# Altium schematic sheet Pg07_ DDR3_Memory.SchDoc: DDR3 MEMORY
size A2; DrawnBy: RvS; DocumentNumber: 7; SheetNumber: 7; SheetTotal: 16
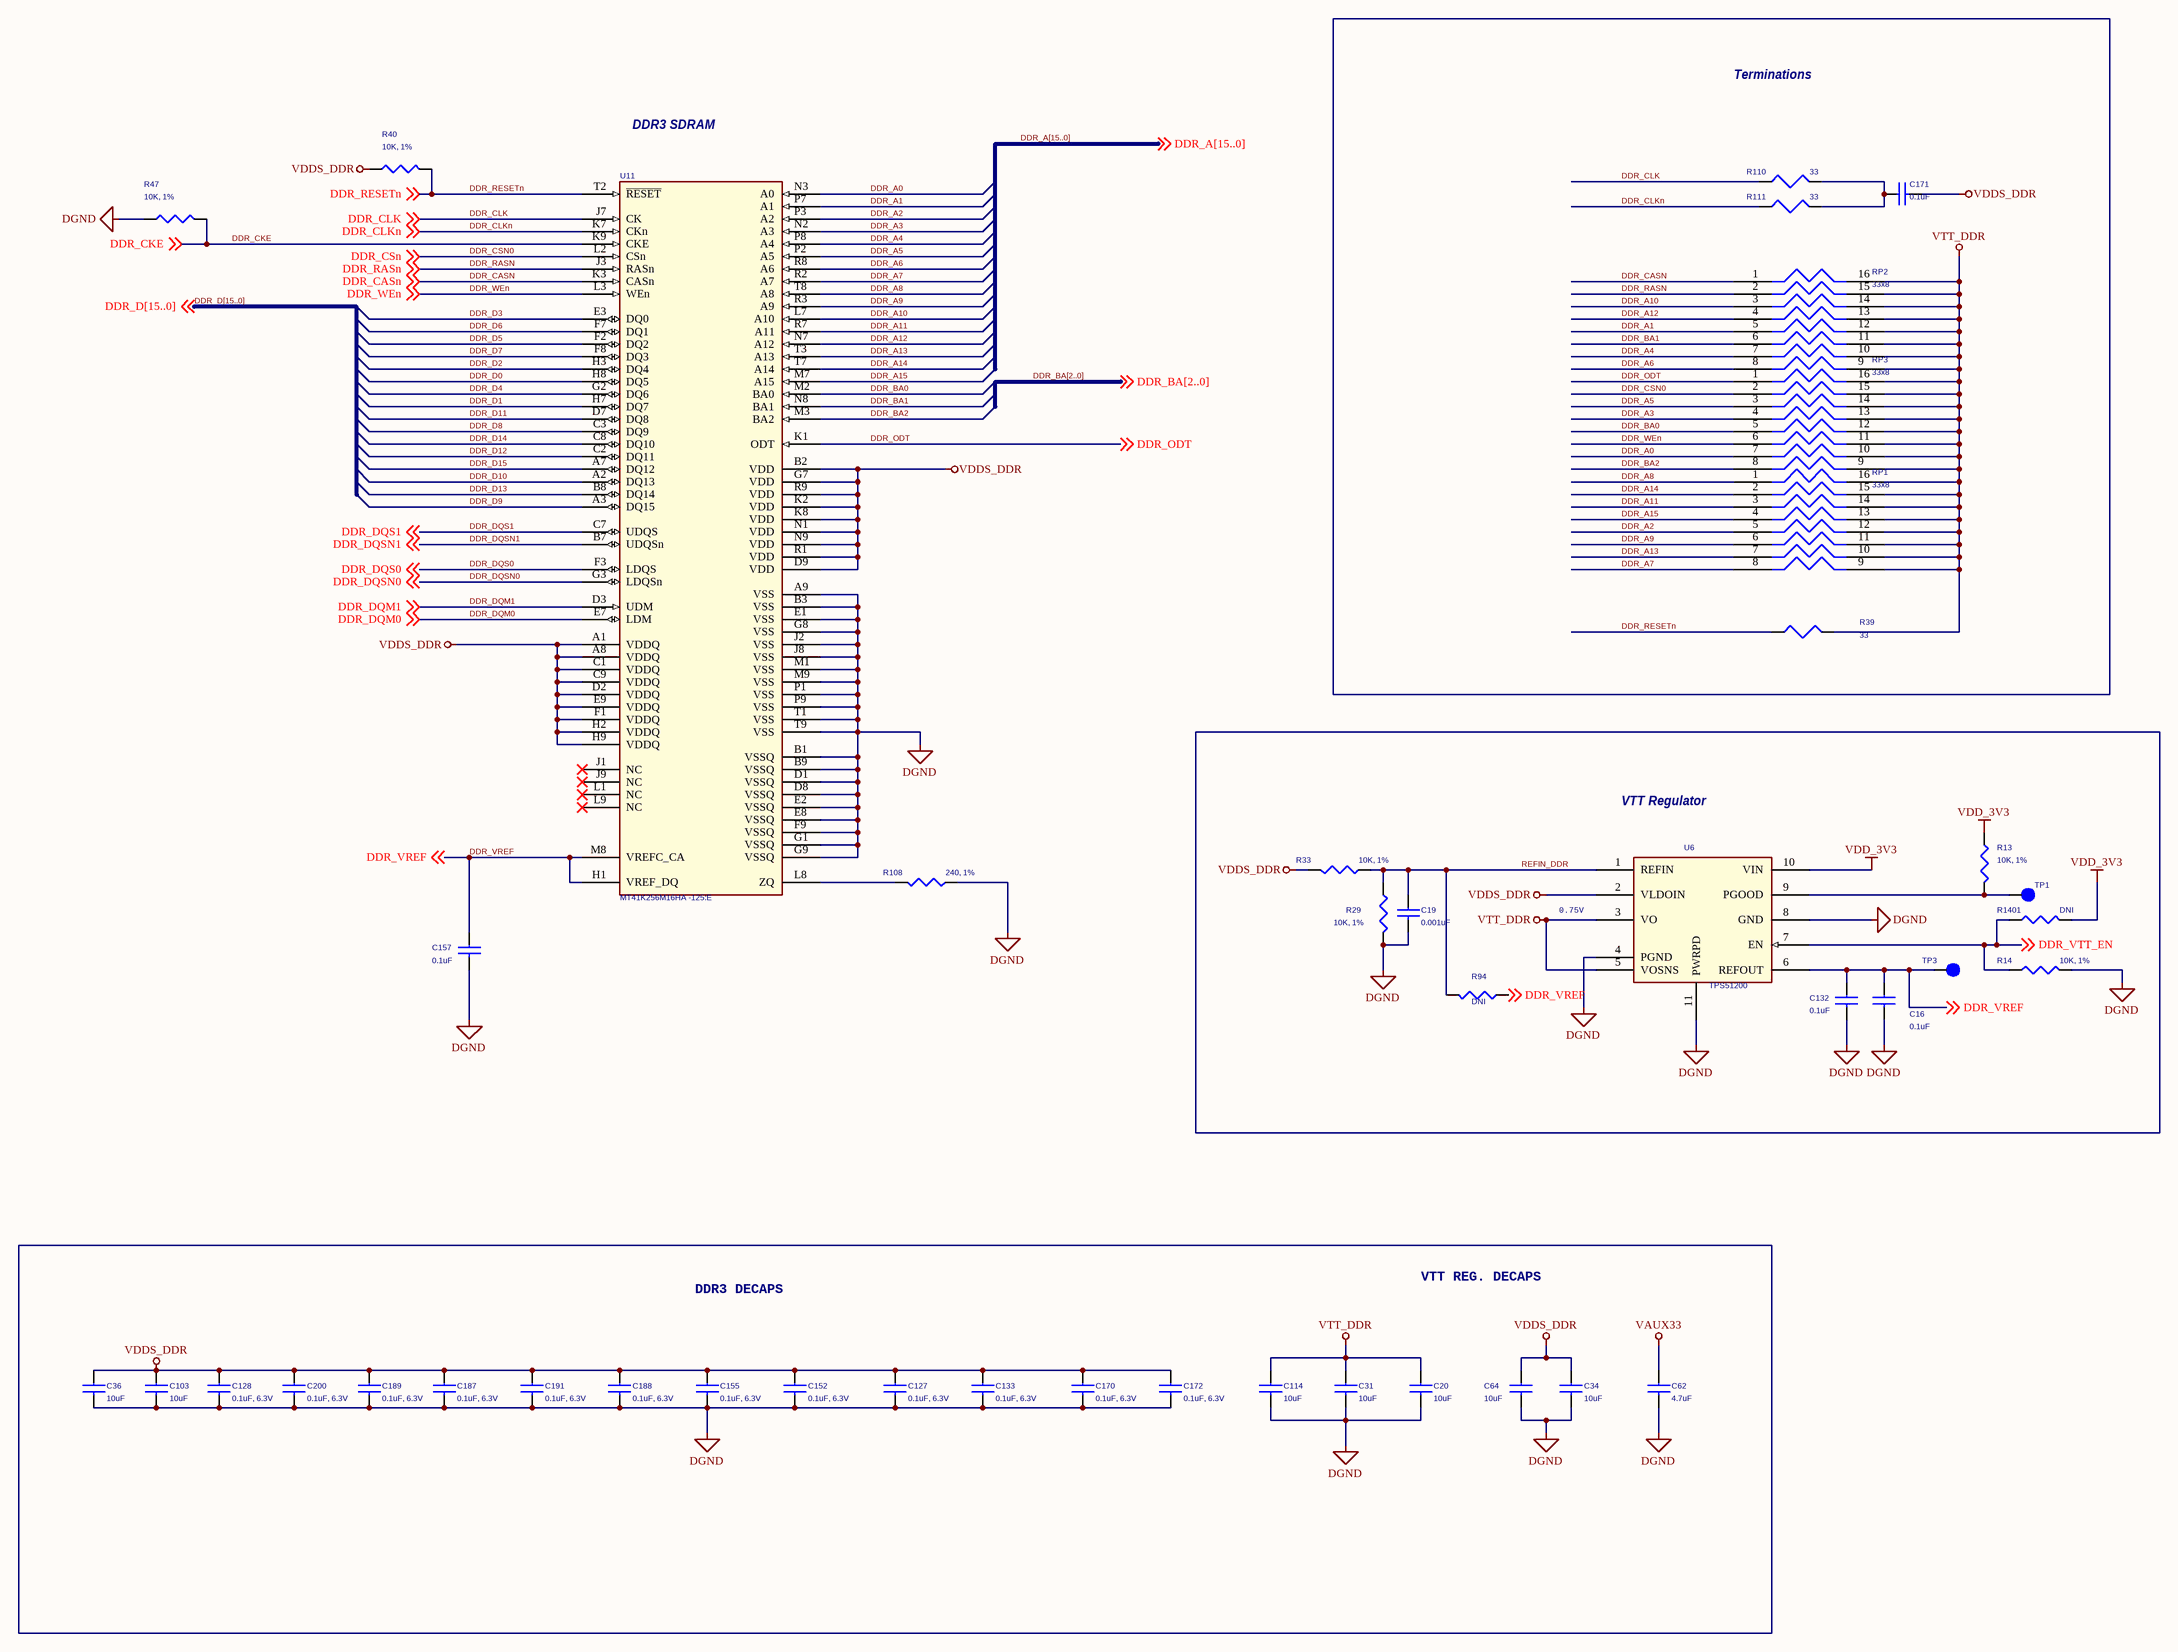
[diagram p0: Pg07_ DDR3_Memory.SchDoc]

## Parts
?  (no value)  (graphical)
C16  0.1uF  [SM-7351-CAP-0402]
C19  0.001uF  [SM-7351-CAP-0402]
C20  10uF  [SM-7351-CAP-0805]
C31  10uF  [SM-7351-CAP-0805]
C34  10uF  [SM-7351-CAP-0805]
C36  10uF  [SM-7351-CAP-0805]
C62  4.7uF  [SM-7351-CAP-0603]
C64  10uF  [SM-7351-CAP-0805]
C103  10uF  [SM-7351-CAP-0805]
C114  10uF  [SM-7351-CAP-0805]
C127  0.1uF, 6.3V  [SM-7351-CAP-0402]
C128  0.1uF, 6.3V  [SM-7351-CAP-0402]
C132  0.1uF  [SM-7351-CAP-0402]
C133  0.1uF, 6.3V  [SMD0201]
C152  0.1uF, 6.3V  [SM-7351-CAP-0402]
C155  0.1uF, 6.3V  [SMD0201]
C157  0.1uF  [SM-7351-CAP-0402]
C170  0.1uF, 6.3V  [SM-7351-CAP-0402]
C171  0.1uF  [SM-7351-CAP-0402]
C172  0.1uF, 6.3V  [SM-7351-CAP-0402]
C187  0.1uF, 6.3V  [SM-7351-CAP-0402]
C188  0.1uF, 6.3V  [SM-7351-CAP-0402]
C189  0.1uF, 6.3V  [SM-7351-CAP-0402]
C191  0.1uF, 6.3V  [SM-7351-CAP-0402]
C200  0.1uF, 6.3V  [SMD0201]
R13  10K, 1%  [SM-7351-RES-0402]
R14  10K, 1%  [SM-7351-RES-0402]
R29  10K, 1%  [SM-7351-RES-0402]
R33  10K, 1%  [SM-7351-RES-0402]
R39  33  [SM-7351-RES-0402]
R40  10K, 1%  [SM-7351-RES-0402]
R47  10K, 1%  [SM-7351-RES-0402]
R94  DNI  [SM-7351-RES-0402]
R108  240, 1%  [SM-7351-RES-0402]
R110  33  [SM-7351-RES-0402]
R111  33  [SM-7351-RES-0402]
R1401  DNI  [SM-7351-RES-0402]
RP1  33x8  [sm_rpak_exb-2hv]
RP2  33x8  [sm_rpak_exb-2hv]
RP3  33x8  [sm_rpak_exb-2hv]
TP1  TP1mm  [tp_smd1mmcircle]  (value not drawn)
TP3  TP1mm  [tp_smd1mmcircle]  (value not drawn)
U6  TPS51200  [SON10]
U11  MT41K256M16HA -125:E  [BGA14X10-96]

## Blocks framed on the sheet
Terminations: C171 R39 R110 R111 RP1-RP3
VTT Regulator: C16 C19 C132 R13 R14 R29 R33 R94 R1401 TP1 TP3 U6

## Nets
DGND: C16.2 C19.2 C20.2 C31.2 C34.2 C36.2 C62.2 C64.2 C103.2 C114.2 C127.2 C128.2 C132.2 C133.2 C152.2 C155.2 C157.2 C170.2 C172.2 C187.2 C188.2 C189.2 C191.2 C200.2 R14.2 R29.2 R47.1 R108.1 U6.4(PGND) U6.8(GND) U6.11(PWRPD) U11.A9(VSS) U11.B1(VSSQ) U11.B3(VSS) U11.B9(VSSQ) U11.D1(VSSQ) U11.D8(VSSQ) U11.E1(VSS) U11.E2(VSSQ) U11.E8(VSSQ) U11.F9(VSSQ) U11.G1(VSSQ) U11.G8(VSS) U11.G9(VSSQ) U11.J2(VSS) U11.J8(VSS) U11.M1(VSS) U11.M9(VSS) U11.P1(VSS) U11.P9(VSS) U11.T1(VSS) U11.T9(VSS)
VAUX33: C62.1
VDD_3V3: R13.1 R1401.2 U6.10(VIN)
VDDS_DDR: C34.1 C36.1 C64.1 C103.1 C127.1 C128.1 C133.1 C152.1 C155.1 C170.1 C171.2 C172.1 C187.1 C188.1 C189.1 C191.1 C200.1 R33.2 R40.1 U6.2(VLDOIN) U11.A1(VDDQ) U11.A8(VDDQ) U11.B2(VDD) U11.C1(VDDQ) U11.C9(VDDQ) U11.D2(VDDQ) U11.D9(VDD) U11.E9(VDDQ) U11.F1(VDDQ) U11.G7(VDD) U11.H2(VDDQ) U11.H9(VDDQ) U11.K2(VDD) U11.K8(VDD) U11.N1(VDD) U11.N9(VDD) U11.R1(VDD) U11.R9(VDD)
VTT_DDR: C20.1 C31.1 C114.1 R39.2 RP1.9 RP1.10 RP1.11 RP1.12 RP1.13 RP1.14 RP1.15 RP1.16 RP2.9 RP2.10 RP2.11 RP2.12 RP2.13 RP2.14 RP2.15 RP2.16 RP3.9 RP3.10 RP3.11 RP3.12 RP3.13 RP3.14 RP3.15 RP3.16 U6.3(VO) U6.5(VOSNS)
DDR_A0: RP3.7 U11.N3(A0)
DDR_A1: RP2.5 U11.P7(A1)
DDR_A2: RP1.5 U11.P3(A2)
DDR_A3: RP3.4 U11.N2(A3)
DDR_A4: RP2.7 U11.P8(A4)
DDR_A5: RP3.3 U11.P2(A5)
DDR_A6: RP2.8 U11.R8(A6)
DDR_A7: RP1.8 U11.R2(A7)
DDR_A8: RP1.1 U11.T8(A8)
DDR_A9: RP1.6 U11.R3(A9)
DDR_A10: RP2.3 U11.L7(A10)
DDR_A11: RP1.3 U11.R7(A11)
DDR_A12: RP2.4 U11.N7(A12)
DDR_A13: RP1.7 U11.T3(A13)
DDR_A14: RP1.2 U11.T7(A14)
DDR_A15: RP1.4 U11.M7(A15)
DDR_BA0: RP3.5 U11.M2(BA0)
DDR_BA1: RP2.6 U11.N8(BA1)
DDR_BA2: RP3.8 U11.M3(BA2)
DDR_CASN: RP2.1 U11.K3(CASn) ; off-sheet DDR_CASn
DDR_CKE: R47.2 U11.K9(CKE) ; off-sheet DDR_CKE
DDR_CLK: R110.1 U11.J7(CK) ; off-sheet DDR_CLK
DDR_CLKn: R111.1 U11.K7(CKn) ; off-sheet DDR_CLKn
DDR_CSN0: RP3.2 U11.L2(CSn) ; off-sheet DDR_CSn  [also labelled DDR_CSn]
DDR_D0: U11.H8(DQ5)
DDR_D1: U11.H7(DQ7)
DDR_D2: U11.H3(DQ4)
DDR_D3: U11.E3(DQ0)
DDR_D4: U11.G2(DQ6)
DDR_D5: U11.F2(DQ2)
DDR_D6: U11.F7(DQ1)
DDR_D7: U11.F8(DQ3)
DDR_D8: U11.C3(DQ9)
DDR_D9: U11.A3(DQ15)
DDR_D10: U11.A2(DQ13)
DDR_D11: U11.D7(DQ8)
DDR_D12: U11.C2(DQ11)
DDR_D13: U11.B8(DQ14)
DDR_D14: U11.C8(DQ10)
DDR_D15: U11.A7(DQ12)
DDR_DQM0: U11.E7(LDM) ; off-sheet DDR_DQM0
DDR_DQM1: U11.D3(UDM) ; off-sheet DDR_DQM1
DDR_DQS0: U11.F3(LDQS) ; off-sheet DDR_DQS0
DDR_DQS1: U11.C7(UDQS) ; off-sheet DDR_DQS1
DDR_DQSN0: U11.G3(LDQSn) ; off-sheet DDR_DQSN0
DDR_DQSN1: U11.B7(UDQSn) ; off-sheet DDR_DQSN1
DDR_ODT: RP3.1 U11.K1(ODT) ; off-sheet DDR_ODT
DDR_RASN: RP2.2 U11.J3(RASn) ; off-sheet DDR_RASn
DDR_RESETn: R39.1 R40.2 U11.T2(~{RESET}) ; off-sheet DDR_RESETn
DDR_VREF: C16.1 C132.1 C157.1 R94.1 TP3.1 U6.6(REFOUT) U11.H1(VREF_DQ) U11.M8(VREFC_CA) ; off-sheet DDR_VREF
DDR_VTT_EN: R14.1 R1401.1 U6.7(EN) ; off-sheet DDR_VTT_EN
DDR_WEn: RP3.6 U11.L3(WEn) ; off-sheet DDR_WEn
REFIN_DDR: C19.1 R29.1 R33.1 R94.2 U6.1(REFIN)
NetC171_1: C171.1 R110.2 R111.2
NetR13_2: R13.2 TP1.1 U6.9(PGOOD)
NetR108_2: R108.2 U11.L8(ZQ)

Not connected (* = marked no-connect by the designer): U11 J1(NC)* J9(NC)* L1(NC)* L9(NC)*

## Buses and harness runs
bus DDR_A[15..0]
bus DDR_BA[2..0]
bus DDR_D[15..0]

## Notes on the sheet
- DDR3 SDRAM
- 0.75V
- VTT REG. DECAPS
- DDR3 DECAPS
- Embedded Vision Systems Group
- Title
- School of Electrical and Electronic Engineering
- Date:
- Size
- Document Number
- Sheet
- of
- Rev

## Library data of the parts
? = Title Block Address(1): UoM title block
C16 C132 C157 C171 = 0.1uFCapacitor16V10%0402_Dup1: TIIntPartnumber: 1C0089; MfrNum: C0402C104K4RACT; Mfr: Kemet; PartName: 0.1uF16V10%SMD0402; DescriptiveText: Capacitor 0.1uF 16V 10% 0402 X7R; Cost10K: 0.015; Cost100: 0.11; Vendor: Digikey
C19 = 0.001uFCapacitor50V5%0402: Mfr: AVX; PartName: 0.001uF50V5%SMD0402; MfrNum: 04025C102JAT2A; TIIntPartnumber: 1C0093; PN: 0402YC103KAT2A; TN: 207-0054-000; Vendor: Digikey; Cost100: 0.015; Cost10K: 0.007; DescriptiveText: Capacitor 0.001uF 50V 5% 0402
C20 C31 C34 C36 C64 C103 C114 = 10uFCapacitor16V10%0805: Capacitor 10uF 16V 10% Ceramic 0805; PartName: 10uF16V10%SMD0805; Mfr: AVX; MfrNum: 0805YD106KAT2A; TIIntPartnumber: 1C0085; Vendor: Digikey; Cost100: 0.19; Cost10K: 0.042; Descriptive_Text: Capacitor 10uF 16V 10% Ceramic 0805; DescriptiveText: Capacitor 10uF 16V 10% Ceramic 0805
C62 = 4.7uFCapacitor16V10%0603: TIIntPartnumber: 1C0103; MfrNum: EMK107ABJ475KA-T; Mfr: Taiyo Yuden; PartName: 4.7uF16V10%SMD0603; Cost10K: 0.00590; Cost100: 0.0198; Vendor: Digikey; DescriptiveText: Capacitor Ceramic 4.7uF 16V 10% 0603
C127 C128 C133 C152 C155 C170 C172 C187-C189 C191 C200 = 0.1uFCapacitor6.3V10%0201: PartName: 0.1uF6.3V10%smd0201; Mfr: Murata; MfrNum: GRM033R60J104KE19D; TIIntPartnumber: 1C0122; Vendor: Digikey; Cost100: 0.029; Cost10K: 0.0090; DescriptiveText: Capacitor 0.1uF 6.3V 10% 0201 X5R
R13 R29 R33 R94 = 10KOhmResistor1/10W1%0402_Dup3: TIIntPartnumber: 1R0254; MfrNum: ERJ-2RKF1002X; Mfr: Panasonic-ECG; PartName: 10Kohm1/10W1%smd0402; DescriptiveText: Resistor 10Kohm 1/10W 1% 0402; Cost10K: 0.00291; Cost100: 0.011; Vendor: Digikey
R14 R1401 = 10KOhmResistor1/10W1%0402: TIIntPartnumber: 1R0254; MfrNum: ERJ-2RKF1002X; Mfr: Panasonic-ECG; PartName: 10Kohm1/10W1%smd0402; DescriptiveText: Resistor 10Kohm 1/10W 1% 0402; Cost10K: 0.00291; Cost100: 0.011; Vendor: Digikey
R39 R110 R111 = 33ohmResistor1/16W5%0402: Resistor 33ohm 1/16W 5% 0402; PartName: 33ohm1/16W5%SMD; Mfr: Panasonic; MfrNum: ERJ-2GEJ330X; TIIntPartnumber: 1R0008; Vendor: Digikey; Cost100: 0.02595; Cost10K: 0.0020; Descriptive_Text: Resistor 33ohm 1/16W 5% 0402; DescriptiveText: Resistor 33ohm 1/16W 5% 0402
R40 R47 = 10KOhmResistor1/10W1%0402_Dup1: TIIntPartnumber: 1R0254; MfrNum: ERJ-2RKF1002X; Mfr: PANASONIC-ECG; PartName: 10Kohm1/10W1%smd0402; DescriptiveText: Resistor 10Kohm 1/10W 1% 0402; Cost10K: 0.00291; Cost100: 0.011; Vendor: DIGIKEY
R108 = 240OhmResistor1/10W1%0402: PartName: 240ohm1/10W1%smd0402; Mfr: Panasonic-ECG; MfrNum: ERJ-2RKF2400X; TIIntPartnumber: 1R0249; Vendor: Digikey; Cost100: 0.02; Cost10K: 0.00132; DescriptiveText: Resistor 240 OHM 1/10W 1% 0402 SMD
RP1-RP3 = 33ohmx8_1/16W5%smd: Resistor 33ohmx8 1/16W 5% Array SMD; Mfr: Panasonic; MfrNum: EXB-2HV330JV; TIIntPartnumber: 1R0196; Vendor: Digikey; Cost100: 0.007; Cost10K: 0.02465; DescriptiveText: Resistor 33ohmx8 1/16W 5% Array SMD; PartName: 33ohmx8_1/16W5%smd; Descriptive_Text: Resistor 33ohmx8 1/16W 5% Array SMD
TP1 TP3 = Testpoint_SMD1mmCircle: Testpoint SMD 1mm circle pad; TIIntPartnumber: 2H0046; Cost10K: 0.00; Cost100: 0; Descriptive_Text: Testpoint SMD 1mm circle pad; Vendor: N/A; MfrNum: N/A; Mfr: N/A; PartName: TestpointSMD1mmCircle; DescriptiveText: Testpoint SMD 1mm circle pad
U6 = TPS51200: TIIntPartnumber: 1A0297; MfrNum: TPS51200DRC; Mfr: TI; Cost10K: 0.39; Cost100: 1.11; Vendor: Digikey; DescriptiveText: DDR Termination Regulator SinkSource; PartName: TPS51200
U11 = MT41K256M16HA: DDR2 SDRAM 2Gb (256Mx8); Manufacturer: Micron Technology; Lead Time: 0 weeks; Peak Solder Temperature: 260 deg C; Supplier 1: Arrow; Supplier Part Number 1: 52128708S9959891N2406; Manufacturer Part Number: MT41K256M16HA-125:E; RoHS: CHINA ROHS: Compliant / EU ROHS: Compliant; Stock 1: 0; Pricing 1: 0=10.09 (USD); Package Quantity: 1; Termination Finish: Sn/Ag/Cu; China ROHS Lead (X -> above / O -> below threshold): O; China ROHS Mercury (X -> above / O -> below threshold): O; China ROHS Cadmium (X -> above / O -> below threshold): O; China ROHS Hex Chromium (X -> above / O -> below threshold): O; China ROHS PBB (X -> above / O -> below threshold): O; China ROHS PBDE (X -> above / O -> below threshold): O; EU_ROHS_PROD_EXEMPTION_BY_SUPP: N/R; ComponentLink1URL: http://components.arrow.com/partservice/dataview/altium/52128708S9959891N2406?apiKey=aa438727d59eed98c4bed826d8d949c84cb5e685b92bf87346a0226bd2658797; ComponentLink1Description: http://components.arrow.com/partservice/dataview/altium/52128708S9959891N2406?apiKey=aa438727d59eed98c4bed826d8d949c84cb5e685b92bf87346a0226bd2658797